# Altium schematic sheet Overcurrent_Protection.SchDoc
size A4; SheetNumber: 4; SheetTotal: 5
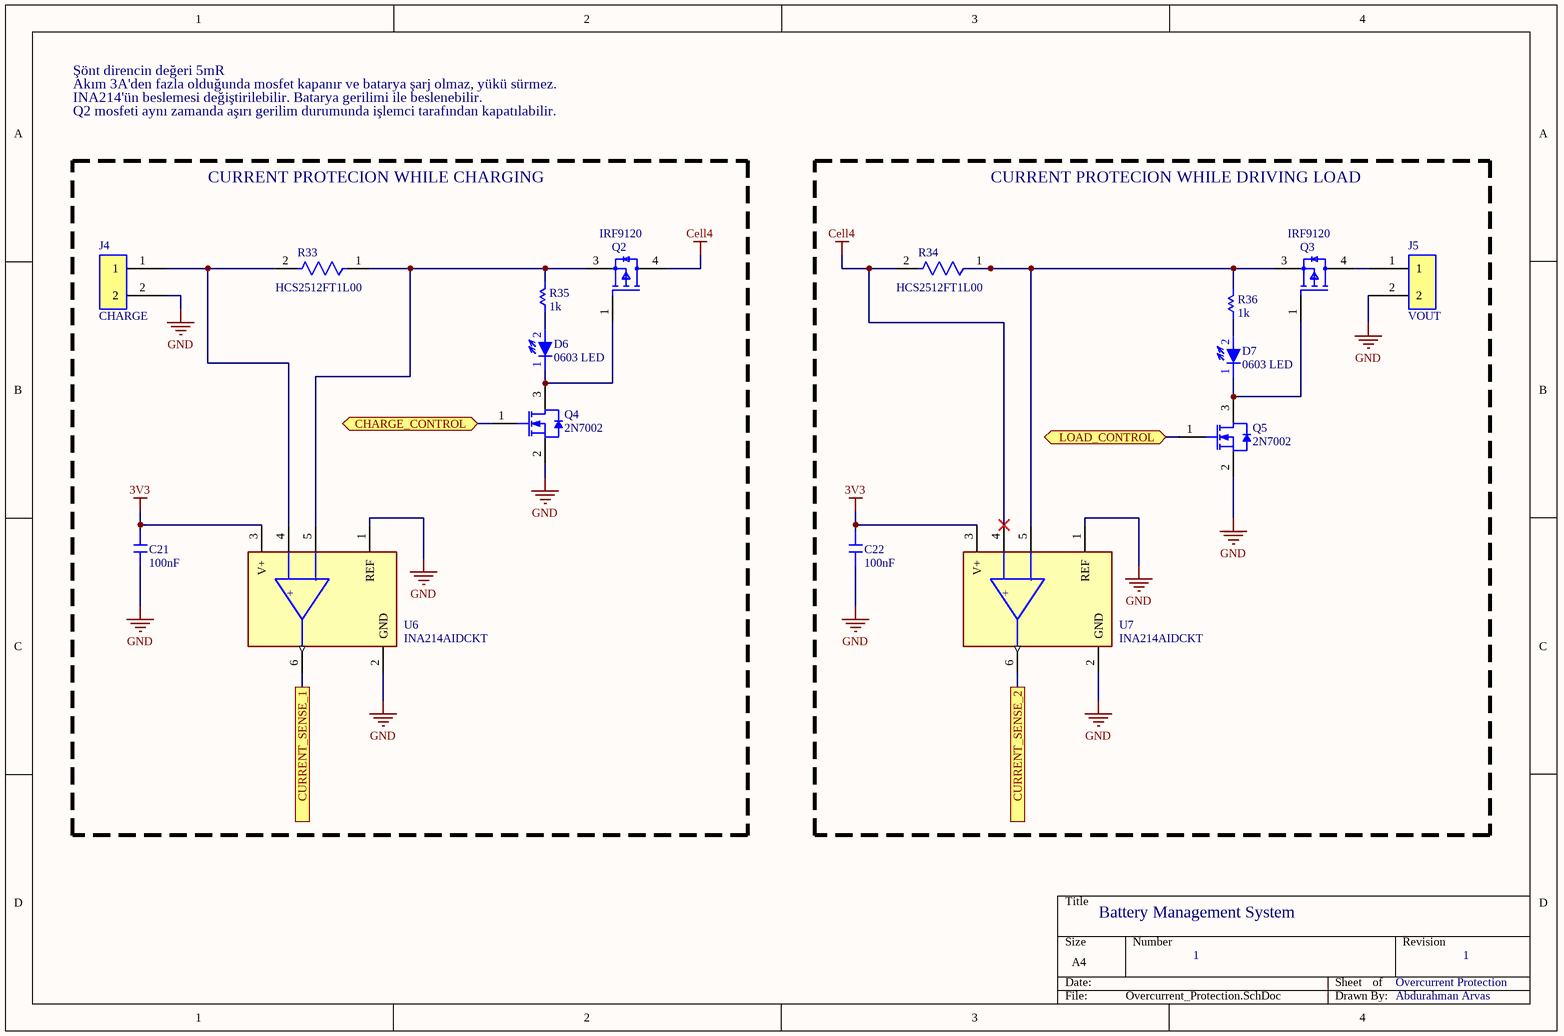
[diagram p0: Overcurrent_Protection.SchDoc]

## Parts
C21  100nF  [C0805]
C22  100nF  [C0805]
D6  0603 LED  [LED_0603]
D7  0603 LED  [LED_0603]
J4  CHARGE  [CONN X2]
J5  VOUT  [CONN X2]
Q2  IRF9120  [FP-TO-252-MFG]
Q3  IRF9120  [FP-TO-252-MFG]
Q4  2N7002  [STM-SOT-23-3_V]
Q5  2N7002  [STM-SOT-23-3_V]
R33  HCS2512FT1L00  [FP-HCS2512FT1L00-MFG]
R34  HCS2512FT1L00  [FP-HCS2512FT1L00-MFG]
R35  1k  [R0805]
R36  1k  [R0805]
U6  INA214AIDCKT  [FP-DCK0006A-MFG]
U7  INA214AIDCKT  [FP-DCK0006A-MFG]

## Blocks framed on the sheet
CURRENT PROTECION WHILE CHARGING: C21 D6 J4 Q2 Q4 R33 R35 U6
CURRENT PROTECION WHILE DRIVING LOAD: C22 D7 J5 Q3 Q5 R34 R36 U7

## Ports
CHARGE_CONTROL (bidir), CURRENT_SENSE_1, CURRENT_SENSE_2, LOAD_CONTROL (bidir)

## Nets
3V3: C21.2 C22.2 U6.3(V+) U7.3(V+)
Cell4: Q2.4(Drain) R34.2 U7.4(IN+)
GND: C21.1 C22.1 J4.2 J5.2 Q4.2(S) Q5.2(S) U6.1(REF) U6.2(GND) U7.1(REF) U7.2(GND)
CHARGE_CONTROL: Q4.1(G) ; port CHARGE_CONTROL
CURRENT_SENSE_1: U6.6(OUT) ; port CURRENT_SENSE_1
CURRENT_SENSE_2: U7.6(OUT) ; port CURRENT_SENSE_2
LOAD_CONTROL: Q5.1(G) ; port LOAD_CONTROL
NetD6_1: D6.1(Cathode) Q2.1(Gate) Q4.3(D)
NetD6_2: D6.2(Anode) R35.1
NetD7_1: D7.1(Cathode) Q3.1(Gate) Q5.3(D)
NetD7_2: D7.2(Anode) R36.1
NetJ4_1: J4.1 R33.2 U6.4(IN+)
NetJ5_1: J5.1 Q3.4(Drain)
NetQ2_3: Q2.3(Source) R33.1 R35.2 U6.5(IN-)
NetQ3_3: Q3.3(Source) R34.1 R36.2 U7.5(IN-)

## Notes on the sheet
- Şönt direncin değeri 5mR
- Akım 3A'den fazla olduğunda mosfet kapanır ve batarya şarj olmaz, yükü sürmez.
- INA214'ün beslemesi değiştirilebilir. Batarya gerilimi ile beslenebilir.
- Q2 mosfeti aynı zamanda aşırı gerilim durumunda işlemci tarafından kapatılabilir.
- Battery Management System
- 1
- Overcurrent Protection
- Abdurahman Arvas
- (in symbol CMP-2000-06456-2) -; +

## Library data of the parts
C21 C22 = SMD_Capacitor
D6 D7 = Led 0603: Light Emitting Diode with 0603 footprint.
J4 J5 = CONN X2: İki Pin Connector
Q2 Q3 = CMP-15615-000002-1: MOSFET P-CHANNEL 60V 20A TO252; Rds On Max: 48mR; Max Power Dissipation: 66W; Input Capacitance: 1.25nF; Mount: Surface Mount; Case/Package: TO-252-3; Min Operating Temperature: -50°C; Continuous Drain Current (ID): 20A; Drain to Source Voltage (Vdss): 60V; Packaging: Cut Tape; RoHS Compliant: Yes; Max Operating Temperature: 150°C
Q4 Q5 = CMP-0434-00001-1: N-channel 60 V, 1.8 Ohm, 0.35 A STripFET(TM) II Power MOSFET, SOT23; Manufacturer: STMicroelectronics; PartNumber: 2N7002; ComponentLink2Description: Datasheet; ComponentLink2URL: http://www.st.com/st-web-ui/static/active/en/resource/technical/document/datasheet/CD00005134.pdf; ComponentLink1Description: Manufacturer URL; ComponentLink1URL: http://www.st.com/; DatasheetVersion: Rev. 9, 11/2008; PackageReference: SOT-23; Mounting Technology: Surface Mount; PackageDescription: 3-Pin SOT23, 3.016 x 2.8 mm Body, 0.95 mm Pitch
R33 R34 = CMP-26527-002753-1: RES 0.001 OHM 1% 3W 2512; Temperature Coefficient: 100ppm/°C; Resistance: 1mR; Min Operating Temperature: -55°C; Features: Moisture Resistant; Number of Terminations: 2; RoHS Compliant: Yes; Resistor Type: Metal Element; Case/Package: 2512; Max Power Dissipation: 3W; Packaging: Tape and Reel; Height: 0.021inch; Tolerance: 1%; Max Operating Temperature: 170°C; Case Code (Imperial): 2512; Length: 0.256inch; Case Code (Metric): 6432; Width: 0.128inch; Package Quantity: 4000
R35 R36 = SMD Resistor: SMD Chip Resistor
U6 U7 = CMP-2000-06456-2: IC CURR SENSE 1 CIRCUIT SC70-6; Manufacturer: Texas Instruments; Voltage Gain: 0.1V/mV; Max Supply Voltage: 26V; Bandwidth: 30kHz; Number Of Channels: 1; Min Supply Voltage: 2.7V; Nominal Supply Current: 65uA; Max Junction Temp: +150°C; Input Offset Voltage: 0.001mV; Standoff Height: 0mm; Input Bias Current: 28uA; Device Class L1: Integrated Circuits (ICs); Device Class L2: Linear ICs; Height: 1.1mm; Temperature Range High: +125°C; Package: DCK0006A; RoHS: TRUE; Temperature: -40°C to +125°C; Automotive: No; Manufacturer Part Number: INA214AIDCKT; Device Class L3: Instrumentation; Mouser Description: Current Sense Amplifiers Hi/Lo-Side Bi-Dir 0- Drift Ser Crnt Shunt; Digikey Description: IC CURR SENSE 1 CIRCUIT SC70-6; ComponentLink2Description: Datasheet; Lead Free: Yes; Ambient Temperature Range High: +125°C; Temperature Range Low: -40°C; ComponentLink2URL: http://www.ti.com/lit/ds/symlink/ina214.pdf; Octopart: https://octopart.com/ina214aidckt-texas+instruments-7830703; Ambient Temperature Range Low: -40°C; Category: IC